# EAGLE design jingle (EAGLE 6.5.0)
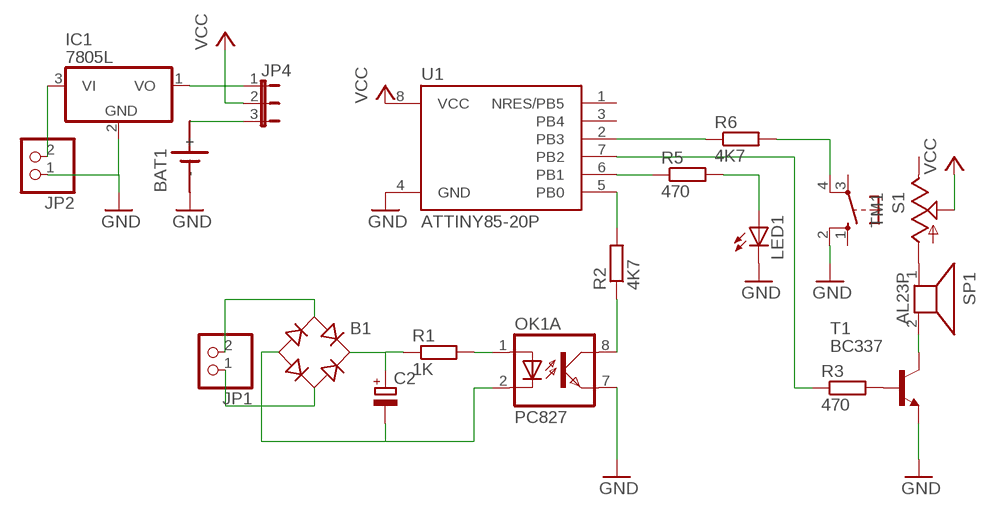
[diagram p0: schematic, sheet 1]

## Parts
B1  RB1A  [RB1A]
BAT1  SN2032  [SN2032]
C2  CPOL-EUTT2D5L  [TT2D5L]
IC1  7805L  [TO92]
JP1  PINHD-1X2  [1X02]
JP2  PINHD-1X2  [1X02]
JP4  JP2E  [JP2]
LED1  LED3MM  [LED3MM]
OK1  PC827  [DIL08]
R1  1K  R-EU_0207/7  [0207/7]
R2  4K7  R-EU_0207/7  [0207/7]
R3  470  R-EU_0207/7  [0207/7]
R5  470  R-EU_0207/7  [0207/7]
R6  4K7  R-EU_0207/7  [0207/7]
S1  10-XX  [B3F-10XX]
SP1  AL23P  [AL23P]
T1  BC337  [TO92]
TM1  TRIM  [6MM]
U1  ATTINY85-20P  [PDIP08_300MIL]

## Nets
GND: BAT1.- IC1.2(GND) JP2.1 LED1.K(C) OK1.7(A:EMIT) S1.2(S1) T1.1(E) U1.4(GND)
N$1: B1.AC2 JP1.1
N$2: B1.AC1 JP1.2
N$3: B1.- C2.- OK1.2(A:C)
N$4: B1.+ C2.+ R1.1
N$5: SP1.2 T1.3(C)
N$6: SP1.1 TM1.A
N$7: OK1.1(A:A) R1.2
N$8: R3.2 T1.2(B)
N$9: R5.1 U1.6(PB1)
N$10: R2.2 U1.5(PB0)
N$11: OK1.8(A:COL) R2.1
N$12: R3.1 U1.7(PB2)
N$13: R6.1 U1.2(PB3)
N$14: R6.2 S1.4(P1)
N$15: LED1.A R5.2
N$18: IC1.3(VI) JP2.2
N$19: IC1.1(VO) JP4.1
N$20: BAT1.+ JP4.3
VCC: JP4.2 TM1.S U1.8(VCC)
Unconnected: OK1.3(B:A) OK1.4(B:C) OK1.5(B:EMIT) OK1.6(B:COL) S1.1(S) S1.3(P) TM1.E U1.1(NRES/PB5) U1.3(PB4)

## Library data of the parts
B1 = rectifier:RB1A: RECTIFIER 1 A
BAT1 = sn2032:SN2032: LI BATTERY
C2 = resistor:CPOL-EU: POLARIZED CAPACITOR, European symbol
IC1 = linear:78*: Positive VOLTAGE REGULATOR Source: http://cache.national.com/ds/LM/LM78L05.pdf http://www.fairchildsemi.com/ds/LM/LM7805.pdf
JP1 JP2 = pinhead:PINHD-1X2: PIN HEADER
JP4 = jumper:JP2E: JUMPER
LED1 = led:LED: LED OSRAM: - CHIPLED LG R971, LG N971, LY N971, LG Q971, LY Q971, LO R971, LY R971 LH N974, LH R974 LS Q976, LO Q976, LY Q976 LO Q996 - Hyper CHIPLED LW Q18S LB Q993, LB Q99A, LB R99A - SideLED LS A670, LO A670, LY A670, LG A670, LP A670 LB A673, LV A673, LT A673, LW A673 LH A674 LY A675 LS A676, LA A676, LO A676, LY A676, LW A676 LS A679, LY A679, LG A679 - Hyper Micro SIDELED® LS Y876, LA Y876, LO Y876, LY Y876 LT Y87S - SmartLED LW L88C, LW L88S LB L89C, LB L89S, LG L890 LS L89K, LO L89K, LY L89K LS L896, LA L896, LO L896, LY L896 - TOPLED LS T670, LO T670, LY T670, LG T670, LP T670 LSG T670, LSP T670, LSY T670, LOP T670, LYG T670 LG T671, LOG T671, LSG T671 LB T673, LV T673, LT T673, LW T673 LH T674 LS T676, LA T676, LO T676, LY T676, LB T676, LH T676, LSB T676, LW T676 LB T67C, LV T67C, LT T67C, LS T67K, LO T67K, LY T67K, LW E67C LS E67B, LA E67B, LO E67B, LY E67B, LB E67C, LV E67C, LT E67C LW T67C LS T679, LY T679, LG T679 LS T770, LO T770, LY T770, LG T770, LP T770 LB T773, LV T773, LT T773, LW T773 LH T774 LS E675, LA E675, LY E675, LS T675 LS T776, LA T776, LO T776, LY T776, LB T776 LHGB T686 LT T68C, LB T68C - Hyper Mini TOPLED® LB M676 - Mini TOPLED Santana® LG M470 LS M47K, LO M47K, LY M47K Source: http://www.osram.convergy.de LUXEON: - LUMILED® LXK2-PW12-R00, LXK2-PW12-S00, LXK2-PW14-U00, LXK2-PW14-V00 LXK2-PM12-R00, LXK2-PM12-S00, LXK2-PM14-U00 LXK2-PE12-Q00, LXK2-PE12-R00, LXK2-PE12-S00, LXK2-PE14-T00, LXK2-PE14-U00 LXK2-PB12-K00, LXK2-PB12-L00, LXK2-PB12-M00, LXK2-PB14-N00, LXK2-PB14-P00, LXK2-PB14-Q00 LXK2-PR12-L00, LXK2-PR12-M00, LXK2-PR14-Q00, LXK2-PR14-R00 LXK2-PD12-Q00, LXK2-PD12-R00, LXK2-PD12-S00 LXK2-PH12-R00, LXK2-PH12-S00 LXK2-PL12-P00, LXK2-PL12-Q00, LXK2-PL12-R00 Source: www.luxeon.com KINGBRIGHT: KA-3528ASYC Source: www.kingbright.com
OK1 = optocoupler:PC827: SHARP OPTO COUPLER; OC_FARNELL: unknown; OC_NEWARK: unknown
R1-R3 R5 R6 = resistor:R-EU_: RESISTOR, European symbol
S1 = switch-omron:10-XX: OMRON SWITCH; MPN: B3F-1000; OC_FARNELL: 176432; OC_NEWARK: 36M3542
SP1 = buzzer:AL23P: SPEAKER Source: Buerklin; OC_FARNELL: unknown; OC_NEWARK: unknown
T1 = transistor:BC337: NPN TRANSISTOR
TM1 = adafruit:TRIM
U1 = _hhn_attiny25_45_85:ATTINY85*: ATMEL ATtiny 85 Packages: P = PDIP 08 30mil S = SOIC 08 EIAJ 208mil Technologies Note: for complete ordering code (temp. range, finish, tape&reel etc.) see www.atmel.com • Supply Voltage: V = (1.8…5.5)V | [blank] = (2.7…5.5)V • Speed: 10 = 10 MHz | 20 = 20 MHz Author: Dipl.-Ing. FH Rainer Bayer HHN Hochschule Heilbronn (Heilbronn University), rainer.bayer@hs-heilbronn.de Ingenieurbüro ing-rb, mail@ing-rb.de

## Board
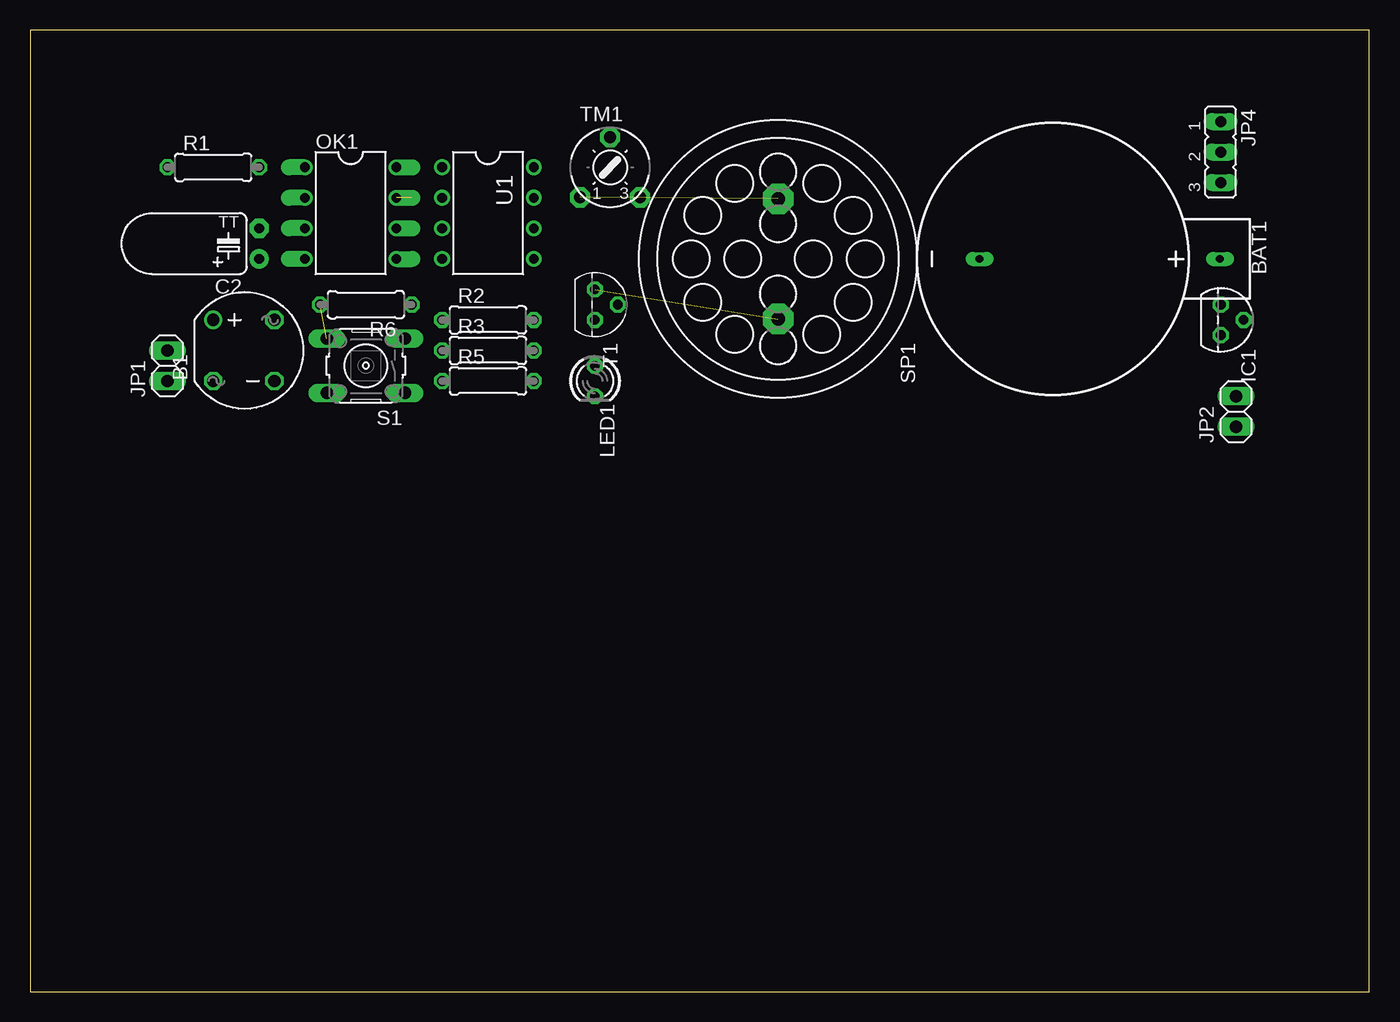
[diagram p1: board, top side]
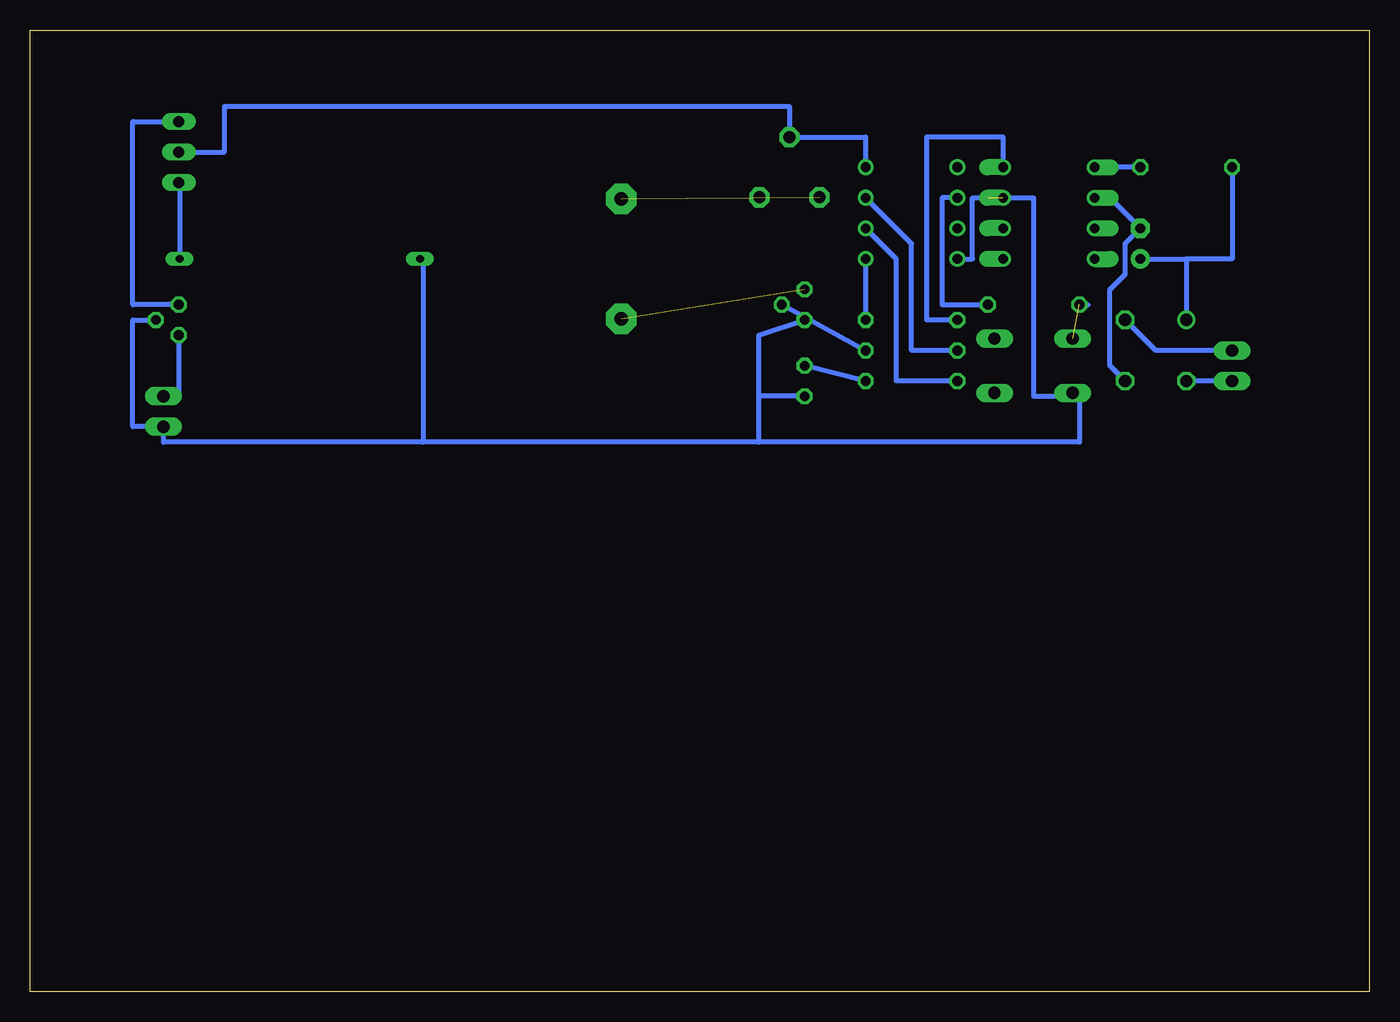
[diagram p2: board, bottom side, seen from below]

Size 111.43 x 80 mm. Coordinates in mm from the lower left corner, seen from the top.
Outline: 0,0 111.43,0 111.43,80 0,80 0,0
Copper layers (1*16): Top 0.035mm / dielectric 1.5mm / Bottom 0.035mm
Design rules "default": minimum track width 10mil, minimum drill 24mil, track to track 8mil, track to pad 8mil, pad to pad 8mil, via to via 8mil, smd to smd 8mil, copper to edge 40mil, drill to drill 8mil, minimum pad ring 10mil, minimum via ring 8mil, stop-mask expansion 4mil, vias tented up to drill 0mil, thermal gap 10mil

### Footprints (pad centres in the part's own frame; a part is rotated, then mirrored left to right if it is on the bottom)
RB1A = drill 1.016: + -2.54,2.54 | drill 1.016 octagon: - 2.54,-2.54; AC1 2.54,2.54; AC2 -2.54,-2.54
SN2032 = drill 0.65 long: + 0,13.9; - 0,-6.1
TT2D5L = drill 0.813 pad 1.6: + -1.27,0 | drill 0.813 pad 1.6 octagon: - 1.27,0
TO92 = drill 0.813 octagon: 1 -1.27,0; 2 0,1.905; 3 1.27,0
1X02 = drill 1.016 long: 1 -1.27,0; 2 1.27,0
JP2 = drill 0.914 long: 1 -2.54,0; 2 0,0; 3 2.54,0
LED3MM = drill 0.813 octagon: A -1.27,0; K 1.27,0
DIL08 = drill 0.813 offset: 1 -3.81,-3.81; 2 -1.27,-3.81; 3 1.27,-3.81; 4 3.81,-3.81; 5 3.81,3.81; 6 1.27,3.81; 7 -1.27,3.81; 8 -3.81,3.81
0207/7 = drill 0.813 octagon: 1 -3.81,0; 2 3.81,0
B3F-10XX = drill 1.016 long: 1 -3.251,2.261; 2 3.251,2.261; 3 -3.251,-2.261; 4 3.251,-2.261
AL23P = drill 1.118 pad 2.54 octagon: 1 -5.004,0; 2 5.004,0
TO92' = drill 0.813 octagon: 1 1.27,0; 2 0,1.905; 3 -1.27,0
6MM = drill 1 pad 1.676 octagon: A -2.5,-2.5; E 2.5,-2.5; S 0,2.5
PDIP08_300MIL = drill 0.813: 1 -3.81,-3.81; 2 -1.27,-3.81; 3 1.27,-3.81; 4 3.81,-3.81; 5 3.81,3.81; 6 1.27,3.81; 7 -1.27,3.81; 8 -3.81,3.81

### Placement (x,y rotation side)
B1  17.78,53.34 0 top
BAT1  85.09,60.96 270 top
C2  19.05,62.23 90 top
IC1  99.06,55.88 270 top
JP1  11.43,52.07 90 top
JP2  100.33,48.26 90 top
JP4  99.06,69.85 270 top
LED1  46.99,50.8 270 top
OK1  26.67,64.77 270 top
R1  15.24,68.58 0 top
R2  38.1,55.88 0 top
R3  38.1,53.34 0 top
R5  38.1,50.8 0 top
R6  27.94,57.15 180 top
S1  27.94,52.07 180 top
SP1  62.23,60.96 270 top
T1  BC337  [TO92']  46.99,57.15 270 top
TM1  48.26,68.58 0 top
U1  38.1,64.77 270 top

### Tracks (layer width: path | path; a pad name or v marks a point on that pad's centre or on a via)
GND  (1 unrouted)
  Bottom 0.406: 50.8,45.72 78.74,45.72 | S1.2 24.13,49.81 24.13,49.53 | 24.13,49.53 24.13,45.72 50.8,45.72 | OK1.7 27.94,66.04 27.94,49.53 24.13,49.53 | U1.4 33.02,60.96 33.02,66.04 31.75,66.04 | BAT1.- 78.74,60.96 78.74,45.72 | 78.74,45.72 100.33,45.72 JP2.1 102.87,46.99 102.87,55.88 IC1.2 | 50.8,45.72 50.8,49.53 | LED1.K 50.8,49.53 | 50.8,49.53 50.8,54.61 T1.1
N$1
  Bottom 0.406: JP1.1 B1.AC2
N$2
  Bottom 0.406: JP1.2 17.78,53.34 B1.AC1
N$3
  Bottom 0.406: B1.- 21.59,52.07 21.59,58.42 20.32,59.69 20.32,62.23 C2.- 21.59,66.04 OK1.2
N$4
  Bottom 0.406: R1.1 11.43,60.96 15.24,60.96 | C2.+ 15.24,60.96 | 15.24,60.96 B1.+
N$5  (1 unrouted)
N$6  (1 unrouted)
N$7
  Bottom 0.406: R1.2 OK1.1
N$8
  Bottom 0.406: T1.2 R3.2
N$9
  Bottom 0.406: R5.1 39.37,50.8 39.37,60.96 U1.6
N$10
  Bottom 0.406: U1.5 R2.2
N$11
  Bottom 0.406: R2.1 36.83,55.88 36.83,71.12 30.48,71.12 OK1.8
N$12
  Bottom 0.406: R3.1 38.1,53.34 38.1,62.23 U1.7
N$13
  Bottom 0.406: U1.2 35.56,66.04 35.56,57.15 R6.1
N$14  (1 unrouted)
  Bottom 0.406: R6.2 23.42,57.15
N$15
  Bottom 0.406: R5.2 LED1.A
N$18
  Bottom 0.406: IC1.3 99.06,49.53 JP2.2
N$19
  Bottom 0.406: IC1.1 102.87,57.15 102.87,72.39 JP4.1
N$20
  Bottom 0.406: JP4.3 98.99,67.31 BAT1.+
VCC
  Bottom 0.406: JP4.2 95.25,69.85 95.25,73.66 48.26,73.66 TM1.S 41.91,71.08 | 41.91,71.08 41.91,71.12 | 41.91,71.08 U1.8